# Altium schematic sheet MING RTD.SchDoc
size A3; SheetNumber: 1; SheetTotal: 1
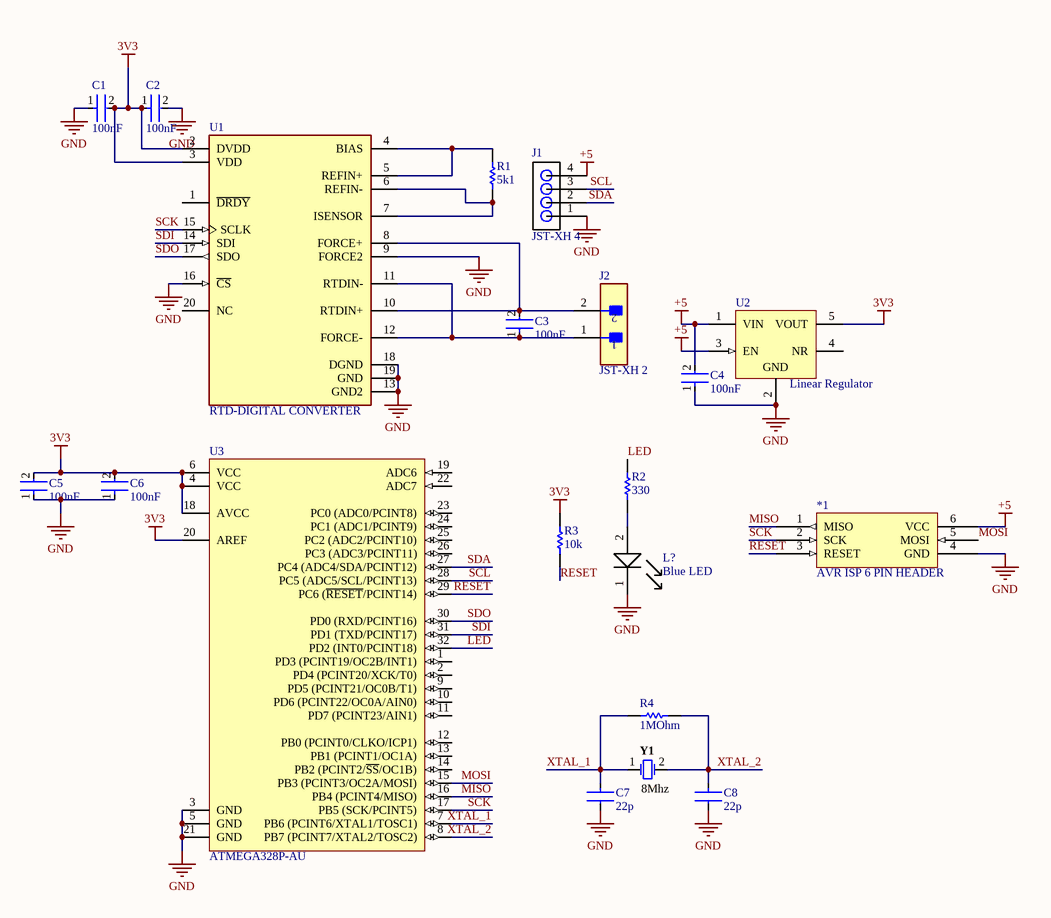
[diagram p0: MING RTD.SchDoc]

## Parts
*1  AVR ISP 6 PIN HEADER  [AVR ISP 6 PIN HEADER]
C1  100nF  [FP-GCM188-0_1-IPC_C]
C2  100nF  [FP-GCM188-0_1-IPC_C]
C3  100nF  [FP-GCM188-0_1-IPC_C]
C4  100nF  [FP-GCM188-0_1-IPC_C]
C5  100nF  [FP-GCM188-0_1-IPC_C]
C6  100nF  [FP-GCM188-0_1-IPC_C]
C7  22p  [CAPC1005X06L]
C8  22p  [CAPC1005X06L]
J1  JST-XH 4  [C146120]
J2  JST-XH 2  [FP-B2B-XH-A_LF_SN-MFG]
L?  Blue LED  [C165977]
R1  5k1  [RESC1608X06L]
R2  330  [RESC1608X06L]
R3  10k  [RESC1608X06L]
R4  1MOhm  [RESC1608X06L]
U1  RTD-DIGITAL CONVERTER  [FP-A20-1-IPC_C]
U2  Linear Regulator  [DBV0005A_L]
U3  ATMEGA328P-AU  [32A_L]
Y1  8Mhz  [C107425]

## Nets
3V3: C1.2 C2.1 C5.2 C6.2 R3.2 U1.2(DVDD) U1.3(VDD) U2.5(VOUT) U3.4(VCC) U3.6(VCC) U3.18(AVCC) U3.20(AREF)
+5: *1.6(VCC) C4.2 U2.1(VIN) U2.3(EN)
GND: *1.4(GND) C1.1 C2.2 C4.1 C5.1 C6.1 C7.2 C8.2 L?.1 U1.9(FORCE2) U1.13(GND2) U1.16(~{CS}) U1.18(DGND) U1.19(GND) U2.2(GND) U3.3(GND) U3.5(GND) U3.21(GND)
LED: R2.2 U3.32(PD2_(INT0/PCINT18))
MISO: *1.1(MISO) U3.16(PB4_(PCINT4/MISO))
MOSI: *1.5(MOSI) U3.15(PB3_(PCINT3/OC2A/MOSI))
RESET: *1.3(RESET) R3.1 U3.29(PC6_(~{RESET}/PCINT14))
SCK: *1.2(SCK) U1.15(SCLK) U3.17(PB5_(SCK/PCINT5))
SCL: U3.28(PC5_(ADC5/SCL/PCINT13))
SDA: U3.27(PC4_(ADC4/SDA/PCINT12))
SDI: U1.14(SDI) U3.31(PD1_(TXD/PCINT17))
SDO: U1.17(SDO) U3.30(PD0_(RXD/PCINT16))
XTAL_1: C7.1 R4.1 U3.7(PB6_(PCINT6/XTAL1/TOSC1)) Y1.1
XTAL_2: C8.1 R4.2 U3.8(PB7_(PCINT7/XTAL2/TOSC2)) Y1.2
NetC3_1: C3.1 J2.1 U1.11(RTDIN-) U1.12(FORCE-)
NetC3_2: C3.2 J2.2 U1.8(FORCE+) U1.10(RTDIN+)
NetL?_2: L?.2 R2.1
NetR1_1: R1.1 U1.6(REFIN-) U1.7(ISENSOR)
NetR1_2: R1.2 U1.4(BIAS) U1.5(REFIN+)

Not connected (* = marked no-connect by the designer): J1 1(8) 2(7) 3(6) 4(5); U1 1(~{DRDY}) 20(NC); U2 4(NR); U3 1(PD3_(PCINT19/OC2B/INT1)) 2(PD4_(PCINT20/XCK/T0)) 9(PD5_(PCINT21/OC0B/T1)) 10(PD6_(PCINT22/OC0A/AIN0)) 11(PD7_(PCINT23/AIN1)) 12(PB0_(PCINT0/CLKO/ICP1)) 13(PB1_(PCINT1/OC1A)) 14(PB2_(PCINT2/~{SS}/OC1B)) 19(ADC6) 22(ADC7) 23(PC0_(ADC0/PCINT8)) 24(PC1_(ADC1/PCINT9)) 25(PC2_(ADC2/PCINT10)) 26(PC3_(ADC3/PCINT11))

## Notes on the sheet
- Labels drawn without touching a wire or pin: +5, GND

## Library data of the parts
C1-C6 = C83054: Tolerance: 10%; Voltage Rating (DC): 25V; Dielectric: X8R; Capacitance: 100nF; Case/Package: 0603; Length: 1.6mm; Packaging: Tape and Reel; Depth: 0.8mm; Lead Free: Lead Free; Max Operating Temperature: 150°C; Min Operating Temperature: -55°C; Supplier 1: Digi-Key
C7 C8 = C161315: CAPC1005X06L due to not in stock
J1 = C146120
J2 = C20079: CONN HEADER VERT 2POS 2.5MM; Current Rating: 3A; Voltage Rating: 250V; Number of Contacts: 2; Contact Resistance: 20mR; Wire/Cable Gauge: 22AWG; Insulation Resistance: 1GR; Connector Type: Male Pin; Packaging: Bulk; Contact Material: Brass; Lead Free: Lead Free; Orientation: Straight; Contact Plating: Tin; Max Current Rating: 3A; Termination: Solder; Fastening Type: Detent; Depth: 5.75mm; Housing Material: Polyamide; REACH SVHC: No SVHC; Series: XH; Voltage Rating (AC): 250V; Number of Positions: 2; Color: Natural; Contact Type: Male Pin; Max Voltage Rating (DC): 250V; Pitch: 2.5mm; Lead Pitch: 2.5mm; Mount: Through Hole; Max Operating Temperature: 85°C; Length: 7.4mm; Max Voltage Rating (AC): 250V; Min Operating Temperature: -25°C; Number of Rows: 1; Housing Color: White; Supplier 1: RSComponents; Supplier Part Number 1: 8201554
L? = C165977
R1 = C23186: Part Number: ERJ-3EKF5101V; Manufacturer: Panasonic
R2 = C23138: Manufacturer: Panasonic; Part Number: ERJ1GNF1004C
R3 = C25804: Part Number: ERJ-3EKF5101V; Manufacturer: Panasonic
R4 = C22935: Manufacturer: Panasonic; Part Number: ERJ1GNF1004C
U1 = C779509: IC RTD TO DIGITAL CONVERT 20SSOP; Output Type: SPI; Min Operating Temperature: -40°C; Packaging: Tape and Reel; Mount: Surface Mount; Case/Package: SSOP; Max Operating Temperature: 125°C
U2 = C202242: Single Output Fast Transient Response LDO, 250 mA, Fixed 3.3 V Output, 1.8 to 12 V Input, 5-pin SOT-23 (DBV), -55 to 125 degC, Green (RoHS & no Sb/Br); Manufacturer: Texas Instruments; PartNumber: REG102NA-3.3/3K; Vin(Max)(V): 12; Accuracy(%): 1.5; Vin(Min)(V): 1.8; Vout Adj(Min)(V): 3.3; Iout(Max)(A): 0.25; Vdo(Typ)(mV): 150; SubFamily: Single Channel LDO; Iq(Typ)(mA): 0.4; DatasheetVersion: SBVS024F; PackageDescription: 5-Pin Plastic Small Outline, Body 1.60 Ãƒâ€” 2.90 mm, Pitch 0.95 mm; Code_JEDEC: MO-178; PackageReference: DBV0005A; PackageVersion: 4073253-4/K; Fixed Output Options(V): 3.3; Mounting Technology: Surface Mount; ComponentLink3Description: Package Specification; ComponentLink2Description: Datasheet; Vout Adj(Max)(V): 3.3; ComponentLink1URL: http://www.ti.com/; ComponentLink3URL: http://www.ti.com/litv/pdf/mpds018i; Eco-Plan: Green (RoHS & no Sb/Br); ComponentLink1Description: Manufacturer URL; ComponentLink2URL: http://www.ti.com/general/docs/lit/getliterature.tsp?genericPartNumber=REG102-33&fileType=pdf
U3 = C14877: 8-bit AVR Microcontroller, 32KB Flash, 1KB EEPROM, 2KB SRAM, 32-pin TQFP, Industrial Grade (-40°C to 85°C); PackageDescription: 32-Lead, 7x7x1.0 mm Body, 0.8mm Lead Pitch, Thin Profile Plastic Quad Flat Package (TQFP); DatasheetVersion: revD, May-2011; RevisionNote: DatasheetVersion & PackageVersion updated. URLs added.; ComponentLink1URL: http://www.atmel.com/; ComponentLink2Description: ATmega48A/48PA/88A/88PA/168A/168PA/328/328P Datasheet; Code_JEDEC: MS-026-ABA; ComponentLink1Description: Manufacturer URL; PackageReference: 32A; ComponentLink3Description: ATmega48A/48PA/88A/88PA/168A/168PA/328/328P Summary; ComponentLink2URL: http://www.atmel.com/dyn/resources/prod_documents/doc8271.pdf; PackageVersion: revC, Oct-2010; ComponentLink3URL: http://www.atmel.com/dyn/resources/prod_documents/8271S.pdf; Supplier 1: RSComponents; Supplier Part Number 1: 1310271
Y1 = C107425: Resistance Weld Crystal, 8 MHz, +/- 30 ppm, -20 to 70 degC, 2-Pin SMD, RoHS, Tape and Reel; Manufacturer: FOX Electronics; Series Resistance: 80Ohm; Load Capacitance: 20pF; Tolerance: 50ppm; Frequency Tolerance: 30ppm; Datasheet URL: http://www.foxonline.com/pdfs/hc49sdlf.pdf; Package Reference: HC49SDLF; Height: 4.5mm; Mount: SurfaceMount; Packaging: TapeandReel; Length: 11.7mm; Termination: SMD/SMT; Number of Pins: 2; Depth: 5mm; Frequency: 8MHz; Min Operating Temperature: -20degC; Package Quantity: 1000; RoHSCompliant: True; Lead Free: LeadFree; Width: 5mm; Case/Package: SMD/SMT; Manufacturer URL: http://www.foxonline.com/; Max Operating Temperature: 70degC; REACH SVHC: NoSVHC; Datasheet Version: 42064.0; Package Description: 2-Pin Surface Mount Device, Body 5 x 11.7 mm; Frequency Stability: 50ppm; ESR (Equivalent Series Resistance): 80Ohm; Radiation Hardening: No